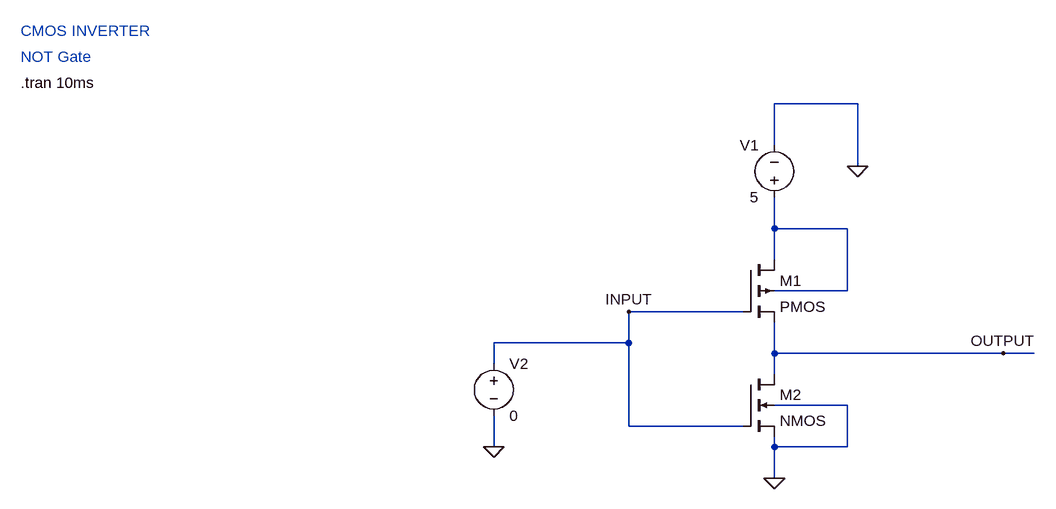
[diagram p0: schematic 1_NOT_gate.asc]
1_NOT_gate.asc, the LTspice schematic file:
Version 4.1
SHEET 1 880 680
WIRE 352 -192 224 -192
WIRE 224 -128 224 -192
WIRE 352 -96 352 -192
WIRE 224 0 224 -48
WIRE 336 0 224 0
WIRE 224 48 224 0
WIRE 336 96 336 0
WIRE 336 96 224 96
WIRE 176 128 0 128
WIRE 0 176 0 128
WIRE 0 176 -208 176
WIRE 224 192 224 144
WIRE 576 192 224 192
WIRE 624 192 576 192
WIRE -208 208 -208 176
WIRE 224 224 224 192
WIRE 336 272 224 272
WIRE 0 304 0 176
WIRE 176 304 0 304
WIRE -208 336 -208 288
WIRE 224 336 224 320
WIRE 336 336 336 272
WIRE 336 336 224 336
WIRE 224 384 224 336
FLAG 224 384 0
FLAG 352 -96 0
FLAG 576 192 OUTPUT
FLAG 0 128 INPUT
FLAG -208 336 0
SYMBOL pmos4 176 48 R0
SYMATTR InstName M1
SYMBOL nmos4 176 224 R0
SYMATTR InstName M2
SYMBOL voltage 224 -32 R180
WINDOW 0 24 96 Left 2
WINDOW 3 24 16 Left 2
WINDOW 123 0 0 Left 0
WINDOW 39 0 0 Left 0
SYMATTR InstName V1
SYMATTR Value 5
SYMBOL voltage -208 192 R0
WINDOW 123 0 0 Left 0
WINDOW 39 0 0 Left 0
SYMATTR InstName V2
SYMATTR Value 0
TEXT -936 -224 Left 2 !.tran 10ms
TEXT -936 -304 Left 2 ;CMOS INVERTER
TEXT -936 -264 Left 2 ;NOT Gate

The netlist it stands for:
* 1_NOT_gate.asc
M1 N001 INPUT OUTPUT N001 PMOS
M2 OUTPUT INPUT 0 0 NMOS
V1 N001 0 5
V2 INPUT 0 0
.model NMOS NMOS
.model PMOS PMOS
.lib standard.mos
.tran 10ms
* CMOS INVERTER
* NOT Gate
.backanno
.end